# EAGLE design Tracksoar v2 flash shield test (EAGLE 9.0.0)
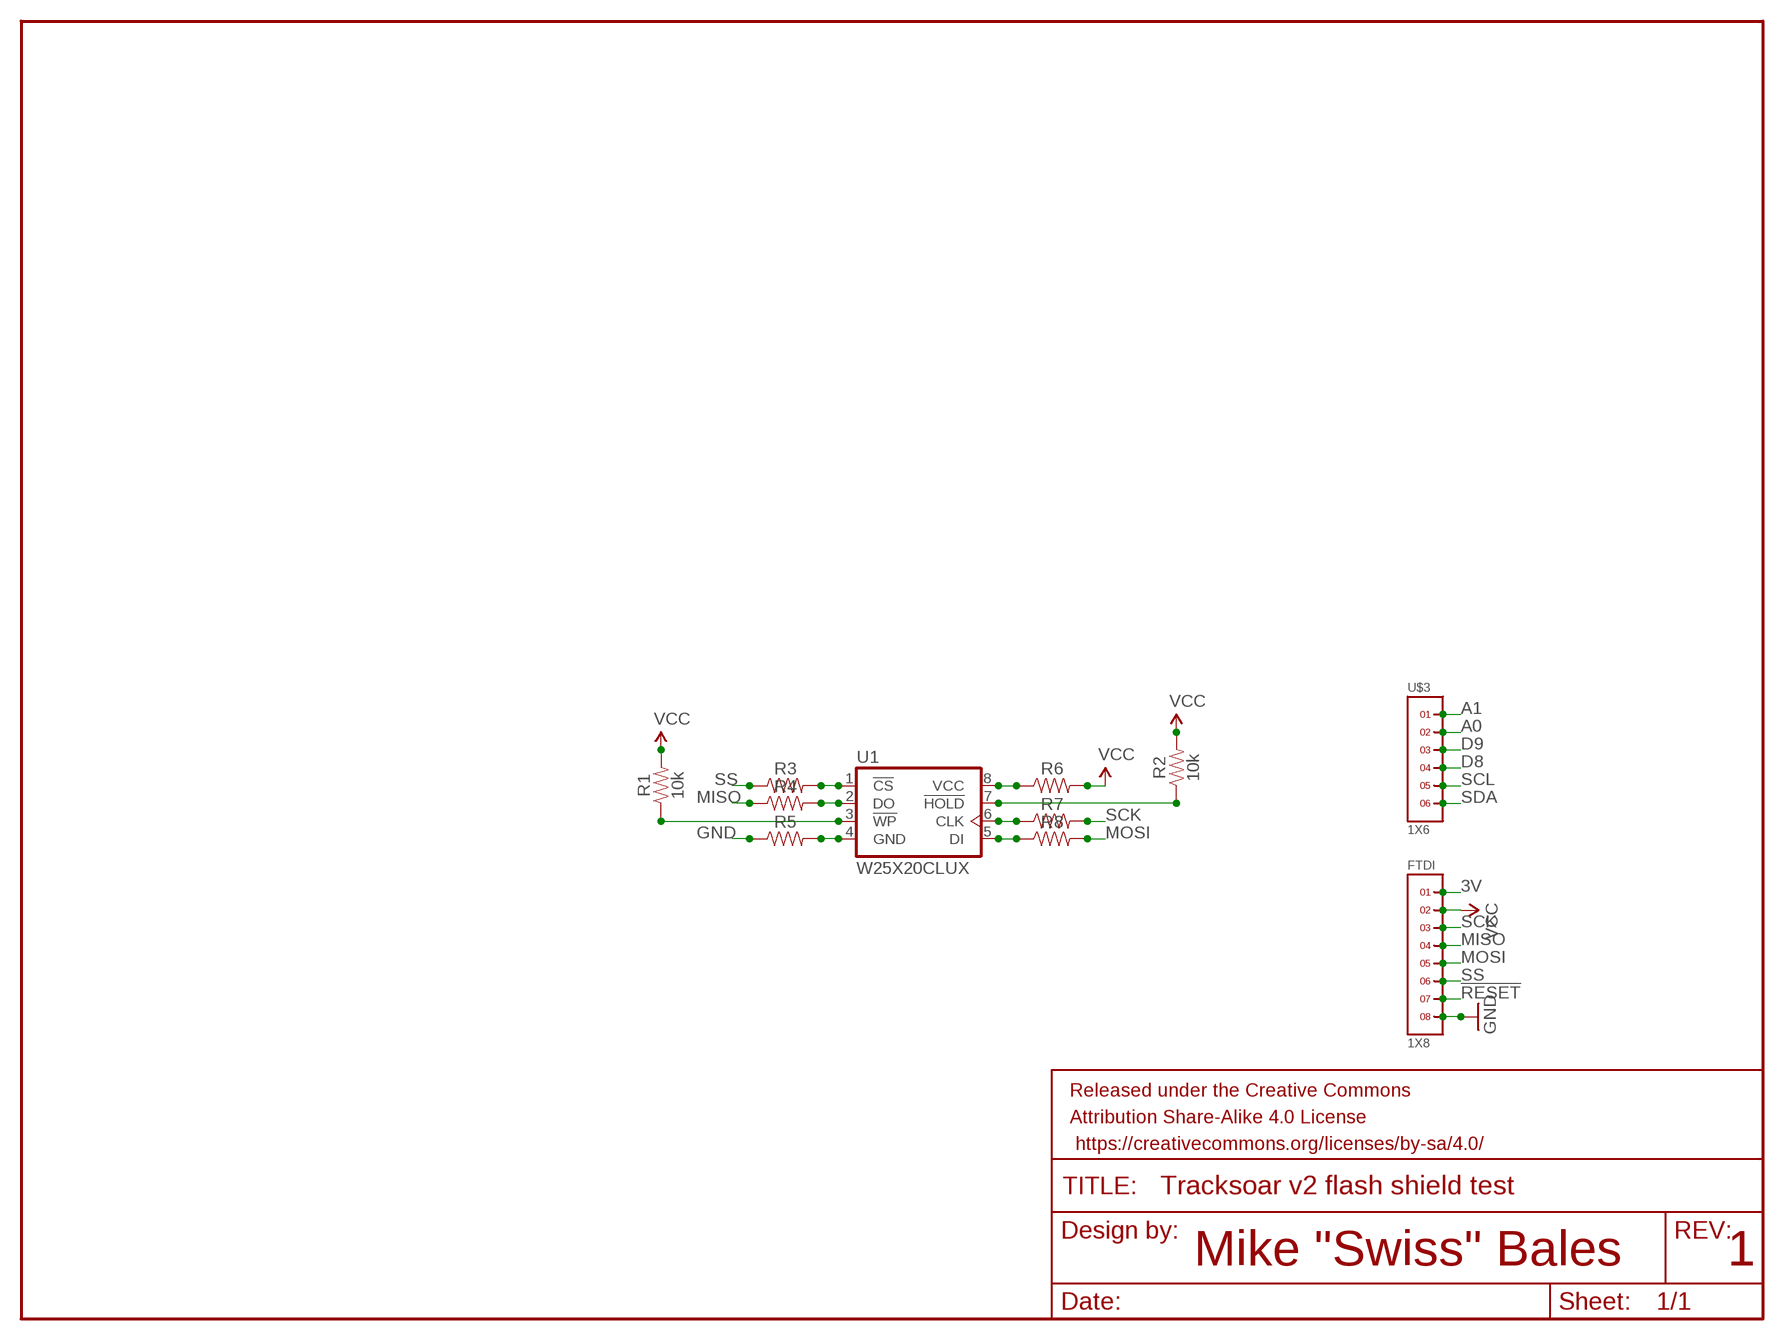
[diagram p0: schematic, sheet 1]

## Parts
FRAME1  FRAME-LETTER  [CREATIVE_COMMONS]
FTDI  1X8  [1X8]
R1  10k  10KOHM-0603-1/10W-1%  [0603]
R2  10k  10KOHM-0603-1/10W-1%  [0603]
R3  RESISTOR0603  [0603]
R4  RESISTOR0603  [0603]
R5  RESISTOR0603  [0603]
R6  RESISTOR0603  [0603]
R7  RESISTOR0603  [0603]
R8  RESISTOR0603  [0603]
U1  W25X20CLUX  [SON-8-50P-300W-200L-100H-40F-20EW-165EL]
U$3  1X6  [1X6]

## Nets
3V: FTDI.1
!RESET: FTDI.7
A0: U$3.2
A1: U$3.1
D8: U$3.4
D9: U$3.3
GND: FTDI.8 R5.1
MISO: FTDI.4 R4.1
MOSI: FTDI.5 R8.2
N$1: R1.1 U1.3(!WP!)
N$2: R2.1 U1.7(!HOLD!)
N$3: R3.2 U1.1(!CS!)
N$6: R4.2 U1.2(DO)
N$7: R5.2 U1.4(GND)
N$8: R6.1 U1.8(VCC)
N$9: R7.1 U1.6(CLK)
N$12: R8.1 U1.5(DI)
SCK: FTDI.3 R7.2
SCL: U$3.5
SDA: U$3.6
SS: FTDI.6 R3.1
VCC: FTDI.2 R1.2 R2.2 R6.2

## Notes on the sheet
- Mike "Swiss" Bales | 1

## Library data of the parts
FRAME1 = SparkFun-Aesthetics:FRAME-LETTER: Schematic Frame Standard 8.5x11 US Letter frame
FTDI = headers(2mm):1X8
R1 R2 = SparkFun-Resistors:10KOHM: 10kΩ resistor A resistor is a passive two-terminal electrical component that implements electrical resistance as a circuit element. Resistors act to reduce current flow, and, at the same time, act to lower voltage levels within circuits. - Wikipedia; PROD_ID: RES-00824
R3-R8 = SparkFun-Resistors:RESISTOR: Generic Resistor Package
U1 = memory-winbond:W25X20CL: EEPROM SPI Serial Flash, 4KB Sectors
U$3 = headers(2mm):1X6

## Board
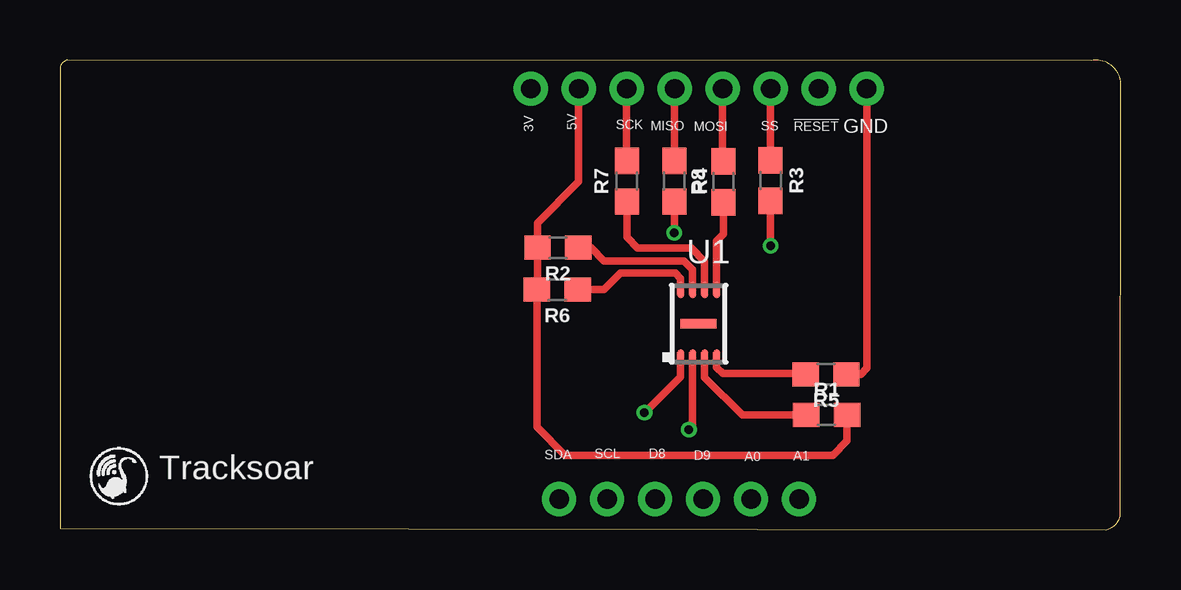
[diagram p1: board, top side]
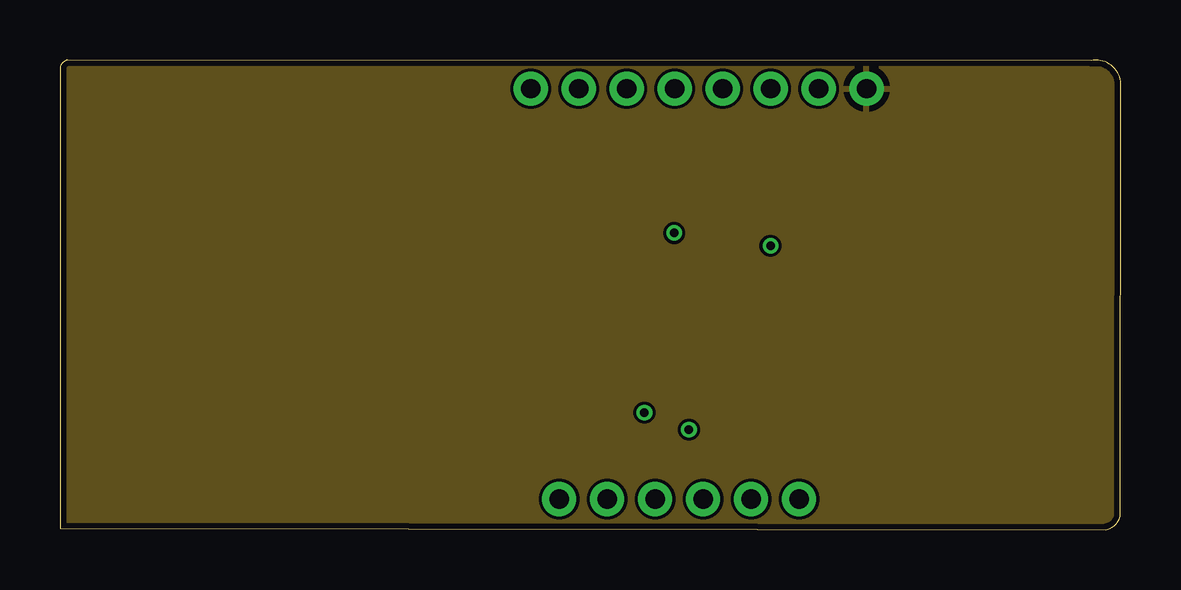
[diagram p2: board, inner layer Route2]
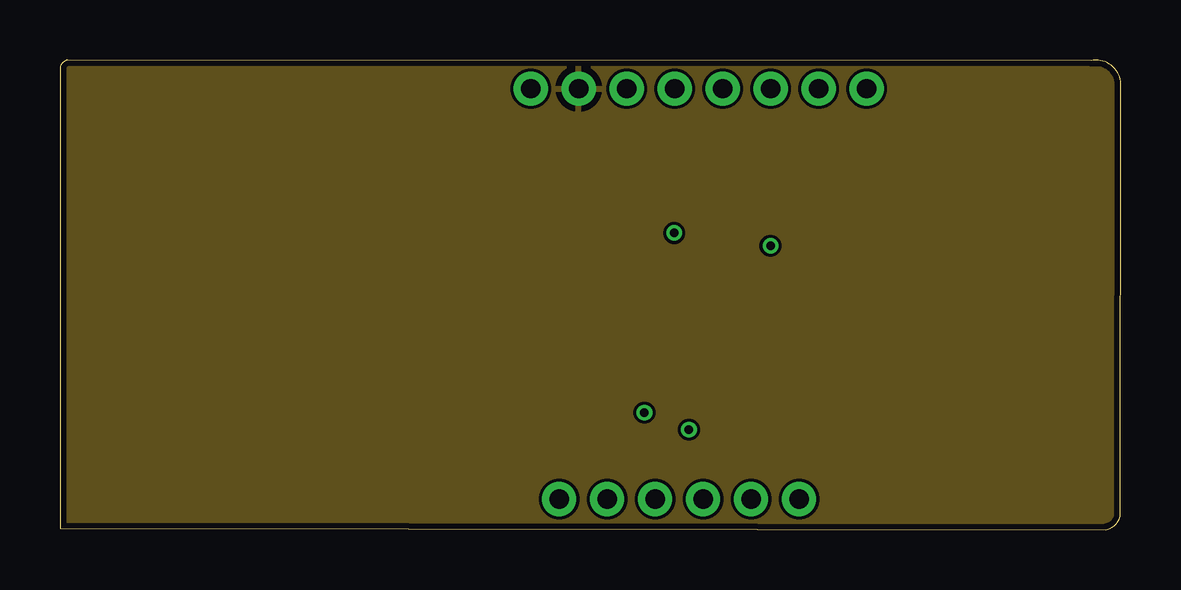
[diagram p3: board, inner layer Route15]
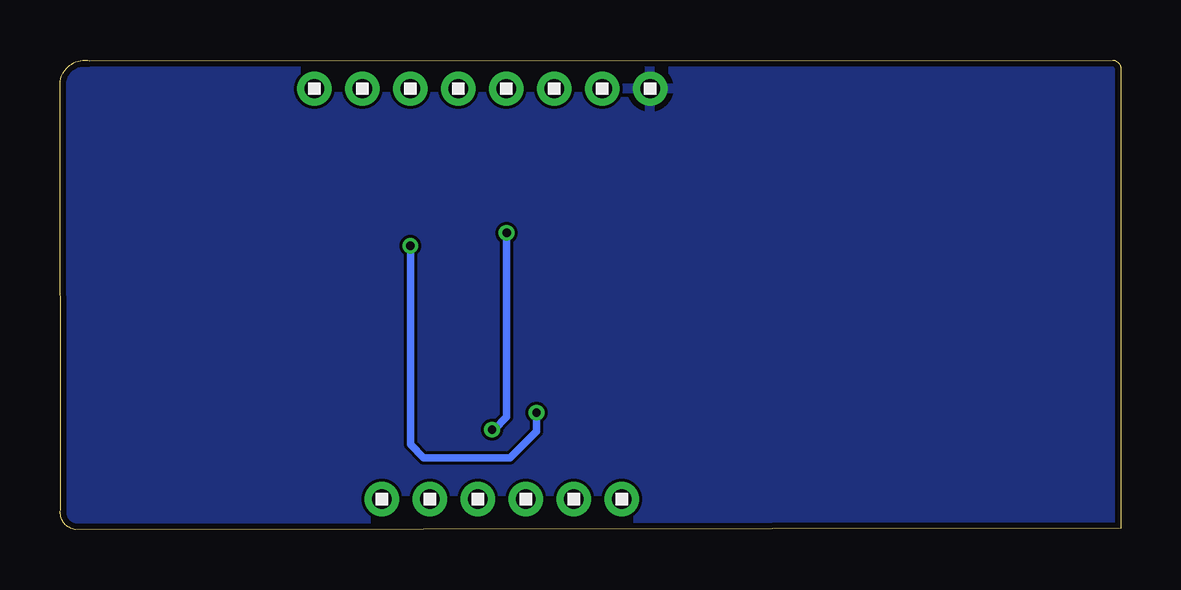
[diagram p4: board, bottom side, seen from below]

Size 44.22 x 19.58 mm. Coordinates in mm from the lower left corner, seen from the top.
Outline: 43.59,0 arc90 44.2,0.81 44.22,18.69 arc90 42.98,19.56 0.33,19.58 arc90 0,19.15 0,0.05 43.59,0
Copper layers (1*2*15*16): Top 0.035mm / dielectric 0.23mm / Route2 0.035mm / dielectric 0.93mm / Route15 0.035mm / dielectric 0.23mm / Bottom 0.035mm
Design rules "MF_Standard_4_Layer": minimum track width 5mil, minimum drill 12mil, track to track 5mil, track to pad 5mil, pad to pad 5mil, via to via 5mil, smd to smd 0mil, copper to edge 10mil, drill to drill 10mil, minimum pad ring 6mil, minimum via ring 6mil, stop-mask expansion 2mil, vias tented up to drill 25mil, thermal gap 10mil

### Footprints (pad centres in the part's own frame; a part is rotated, then mirrored left to right if it is on the bottom)
1X8 = drill 0.8 pad 1.422: 1 -7,0; 2 -5,0; 3 -3,0; 4 -1,0; 5 1,0; 6 3,0; 7 5,0; 8 7,0
0603 = smd 1.1 x 1: 1 -0.85,0; 2 0.85,0
SON-8-50P-300W-200L-100H-40F-20EW-165EL = smd 0.3 x 0.7: 1 -0.75,-1.4; 2 -0.25,-1.4; 3 0.25,-1.4; 4 0.75,-1.4; 5 0.75,1.4; 6 0.25,1.4; 7 -0.25,1.4; 8 -0.75,1.4 | smd 1.5 x 0.4: EP 0,0
1X6 = drill 0.8 pad 1.422: 1 -5,0; 2 -3,0; 3 -1,0; 4 1,0; 5 3,0; 6 5,0

### Placement (x,y rotation side)
FRAME1  42.19,-8.13 0 top  (outside the outline)
FTDI  26.62,18.39 180 bottom
R1  31.96,4.78 0 top
R2  20.75,11.76 180 top
R3  29.62,14.55 270 top
R4  25.61,14.53 270 top
R5  31.93,6.48 180 top
R6  20.73,10.01 180 top
R7  23.63,14.53 90 top
R8  27.66,14.5 90 top
U1  26.62,8.59 0 top
U$3  25.81,1.27 0 bottom

### Tracks (layer width: path | path; a pad name or v marks a point on that pad's centre or on a via)
3V
  pour Bottom: 0.05,19.56 44.2,19.56 44.2,-0.15 0.05,-0.15
GND
  Top 0.305: R5.1 33.38,6.48 33.63,6.73 FTDI.8
  pour Route2: 0.1,19.51 44.2,19.51 44.2,0.03 0.1,0.03
MISO
  Top 0.305: FTDI.4 25.62,15.39 R4.1
MOSI
  Top 0.305: FTDI.5 27.62,15.39 R8.2
N$1
  Top 0.305: U1.3 26.87,6.35 28.45,4.78 R1.1
N$2
  Top 0.305: U1.7 26.37,10.84 26.01,11.2 22.69,11.2 22.13,11.76 R2.1
N$3  (via drill 0.35)
  Top 0.305: U1.1 25.87,6.36 24.39,4.88 v24.36,4.88 | v29.62,11.84 R3.2
  Bottom 0.305: v24.36,4.88 24.36,4.09 25.45,3 29.06,3 29.62,3.56 v29.62,11.84
N$6  (via drill 0.35)
  Top 0.305: R4.2 25.61,12.52 25.63,12.5 25.63,12.4 v25.61,12.37 | v26.22,4.17 26.37,4.32 U1.2
  Bottom 0.305: v25.61,12.37 25.61,4.7 26.14,4.17 v26.22,4.17
N$7
  Top 0.305: U1.4 27.37,6.77 27.64,6.5 31.06,6.5 R5.2
N$8
  Top 0.305: U1.8 25.87,10.48 25.66,10.69 23.37,10.69 22.69,10.01 R6.1
N$9
  Top 0.305: U1.6 26.87,11.18 26.32,11.73 24.08,11.73 23.63,12.19 R7.1
N$12
  Top 0.305: U1.5 27.37,12.03 27.66,12.32 R8.1
SCK
  Top 0.305: FTDI.3 R7.2
SS
  Top 0.305: FTDI.6 R3.1
VCC
  Top 0.305: FTDI.2 21.62,14.51 19.91,12.79 R2.2 19.91,10.03 R6.2 19.88,4.28 21.06,3.1 32.21,3.1 32.81,3.69 R1.2
  pour Route15: 0.08,19.61 44.2,19.61 44.2,-0.05 0.08,-0.05

### Text on the board
tNames: 3V | 5V | SCK | MISO | MOSI | SS | !RESET | GND | SDA | SCL | D8 | D9 | A0 | A1 | Tracksoar